# Altium schematic sheet gain_setting.SchDoc
size A4; SheetNumber: 3; SheetTotal: 5
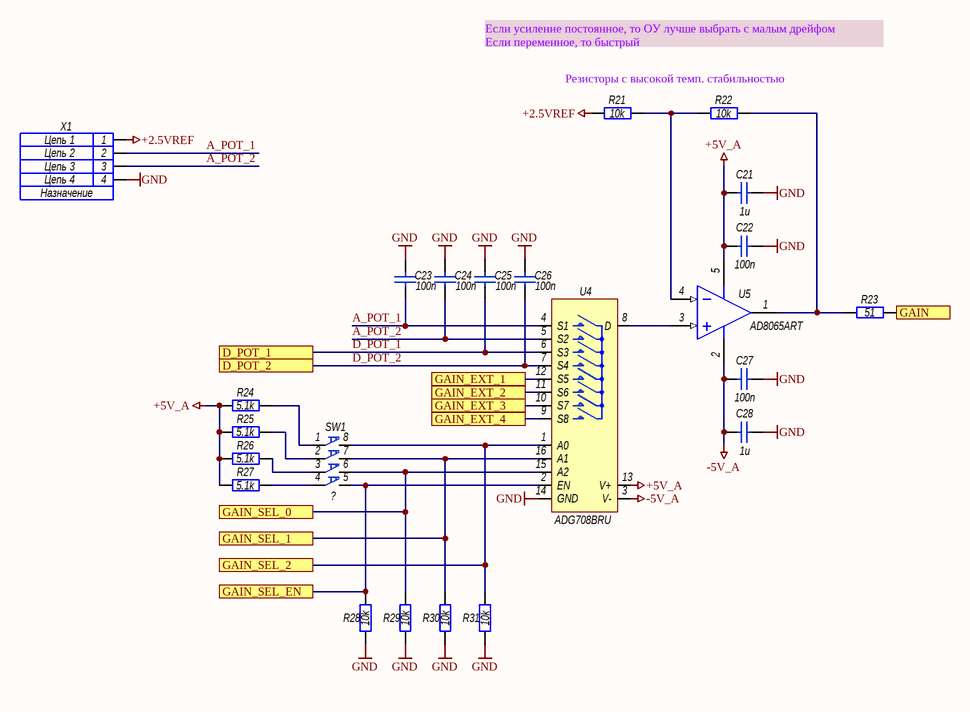
[diagram p0: gain_setting.SchDoc]

## Parts
C21  1u  [CAP_0603]
C22  100n  [CAP_0603]
C23  100n  [CAP_0603]
C24  100n  [CAP_0603]
C25  100n  [CAP_0603]
C26  100n  [CAP_0603]
C27  100n  [CAP_0603]
C28  1u  [CAP_0603]
R21  10k  [RES_0603]
R22  10k  [RES_0603]
R23  51  [RES_0603]
R24  5.1k  [RES_0603]
R25  5.1k  [RES_0603]
R26  5.1k  [RES_0603]
R27  5.1k  [RES_0603]
R28  10k  [RES_0603]
R29  10k  [RES_0603]
R30  10k  [RES_0603]
R31  10k  [RES_0603]
SW1  ?  [SWD3-4]
U4  ADG708BRU  [tssop16]
U5  AD8065ART  [sot235]
X1  Net4: Цепь 4  Net1: Цепь 1  Net2: Цепь 2  Name: Назначение  Net3: Цепь 3  [PLS-4-3D]  (hidden comment: Model)

## Ports
D_POT_1, D_POT_2, GAIN, GAIN_EXT_1, GAIN_EXT_2, GAIN_EXT_3, GAIN_EXT_4, GAIN_SEL_0, GAIN_SEL_1, GAIN_SEL_2, GAIN_SEL_EN

## Nets
+2.5VREF: R21.1 X1.1
+5V_A: C21.1 C22.1 R24.1 R25.1 R26.1 R27.1 U4.13(V+) U5.5(V+)
-5V_A: C27.1 C28.1 U4.3(V-) U5.2(V-)
GND: C21.2 C22.2 C23.2 C24.2 C25.2 C26.2 C27.2 C28.2 R28.1 R29.1 R30.1 R31.1 U4.14(GND) X1.4
A_POT_1: C23.1 U4.4(S1) X1.2
A_POT_2: C24.1 U4.5(S2) X1.3
D_POT_1: C25.1 U4.6(S3) ; port D_POT_1
D_POT_2: C26.1 U4.7(S4) ; port D_POT_2
GAIN: R23.2 ; port GAIN
GAIN_EXT_1: U4.12(S5) ; port GAIN_EXT_1
GAIN_EXT_2: U4.11(S6) ; port GAIN_EXT_2
GAIN_EXT_3: U4.10(S7) ; port GAIN_EXT_3
GAIN_EXT_4: U4.9(S8) ; port GAIN_EXT_4
GAIN_SEL_0: R29.2 SW1.6 U4.15(A2) ; port GAIN_SEL_0
GAIN_SEL_1: R30.2 SW1.7 U4.16(A1) ; port GAIN_SEL_1
GAIN_SEL_2: R31.2 SW1.8 U4.1(A0) ; port GAIN_SEL_2
GAIN_SEL_EN: R28.2 SW1.5 U4.2(EN) ; port GAIN_SEL_EN
NetR21_2: R21.2 R22.1 U5.4(IN-)
NetR22_2: R22.2 R23.1 U5.1(OUT)
NetR24_2: R24.2 SW1.1
NetR25_2: R25.2 SW1.2
NetR26_2: R26.2 SW1.3
NetR27_2: R27.2 SW1.4
NetU4_8: U4.8(D) U5.3(IN+)

## Notes on the sheet
- Если усиление постоянное, то ОУ лучше выбрать с малым дрейфом
  Если переменное, то быстрый
- Резисторы с высокой темп. стабильностью

## Library data of the parts
C21-C28 = Capacitor: Конденсатор
R21 R22 R28-R31 = Resisitor: Резистор; ValueBOM: 0805 10k 0.125; MarkPCB: 103; ValueSCH: 10k
R23-R27 = Resisitor: Резистор; ValueBOM: 0805 10k 0.125; ValueSCH: 10k; MarkPCB: 103
SW1 = SWD3-4: Переключатель 4 группы (под углом) / DS1040-04R; / SWD3-4; / L-KLS7-DP-04-B-00;; ValueBOM: SWD1-4; ValueSCH: SWD1-4; MarkPCB: SWD1-4; HelpURL: C:\Datasheets\.pdf
U4 = MUX 1:8 TSSOP16: Аналоговый ключ 1:8: / DG1208EUE; / ADG1208YRUZ; / ADG1308BRUZ; / ADG1408YRUZ; / ADG1608BRUZ ; / ADG408BRU; / ADG508FBRUZ; / ADG5208BRUZ; / ADG608BRU; / ADG608TRU; / ADG658YRU; / ADG708BRU; / ADG708CRU; / TMUX1108PWR; / MUX508IPW; /; ValueBOM: DG412; ValueSCH: DG412; MarkPCB: DG412
U5 = OPAMP SOT235: Операционный усилитель
X1 = Connector 4: ValueSCH: Model